# Altium schematic sheet LPGDetA1_out_ree.SchDoc
size A4; Subtitle0: Odtworzony schemat; Subtitle1: plytki glownej czujnika ALPA EcoWent - CO; LotOfPieces: 1; SVNPath: SVNPath
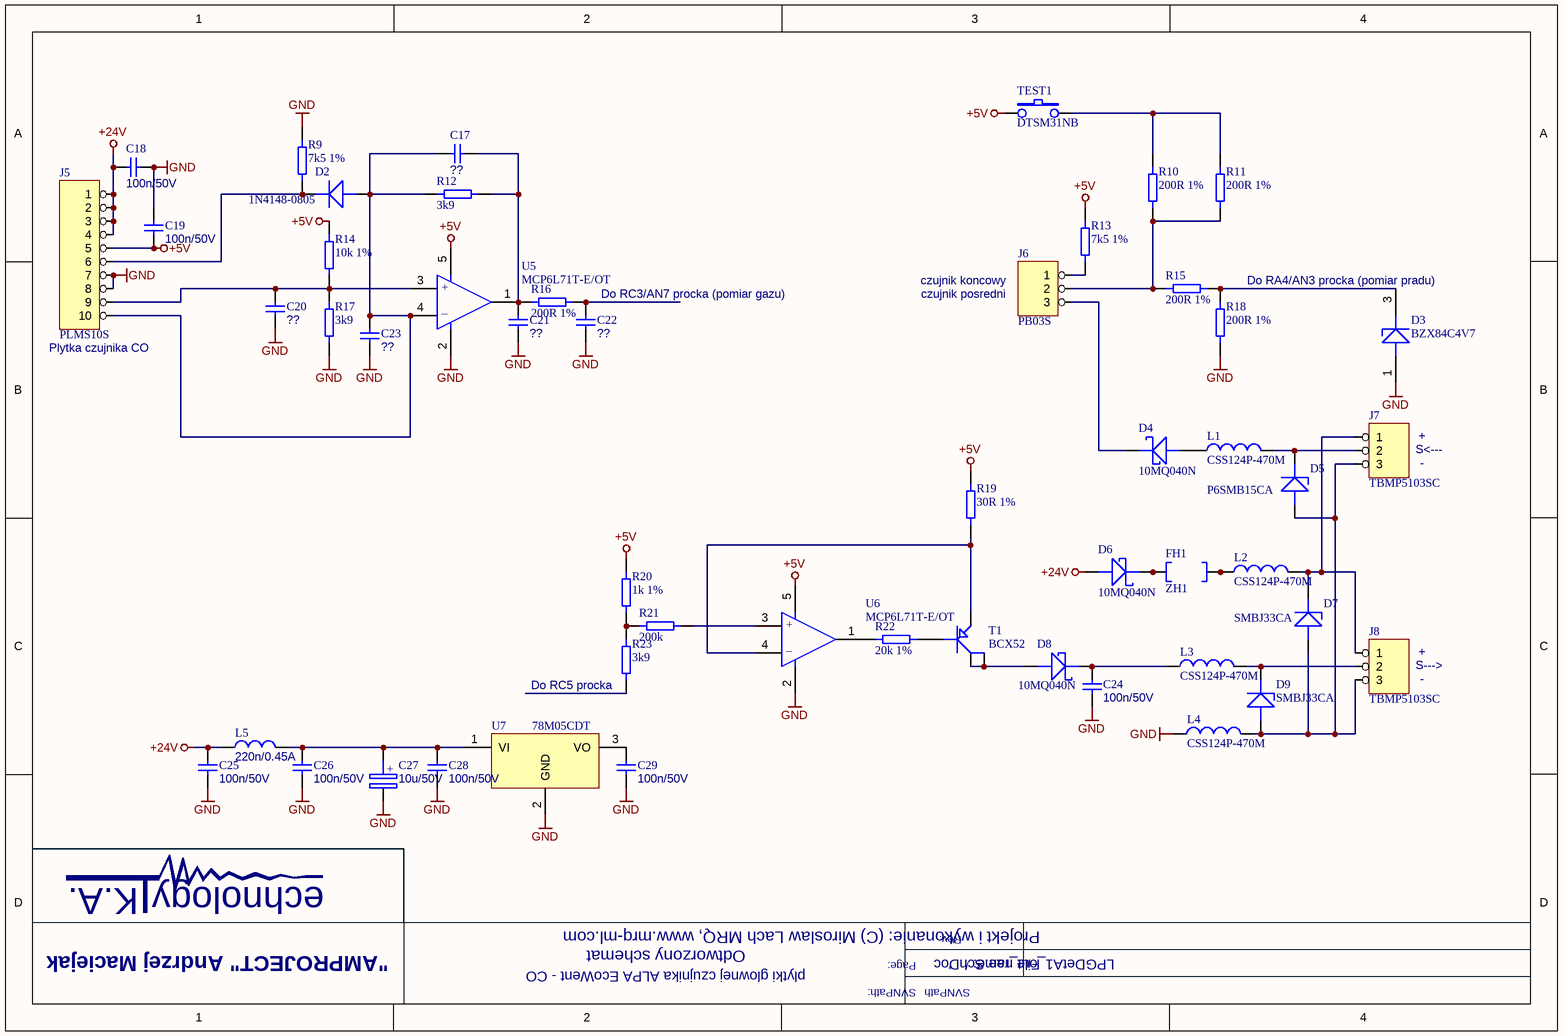
[diagram p0: LPGDetA1_out_ree.SchDoc]

## Parts
?  (no value)
C17  OtherParams: ??  [0805]  (hidden comment: CC0805JRNPO9BN101)
C18  OtherParams: 100n/50V  [0805]  (hidden comment: CL21B104KBCNNNC)
C19  OtherParams: 100n/50V  [0805]  (hidden comment: CL21B104KBCNNNC)
C20  OtherParams: ??  [0805]  (hidden comment: CC0805JRNPO9BN101)
C21  OtherParams: ??  [0805]  (hidden comment: CC0805JRNPO9BN101)
C22  OtherParams: ??  [0805]  (hidden comment: CC0805JRNPO9BN101)
C23  OtherParams: ??  [0805]  (hidden comment: CC0805JRNPO9BN101)
C24  OtherParams: 100n/50V  [0805]  (hidden comment: CL21B104KBCNNNC)
C25  OtherParams: 100n/50V  [0805]  (hidden comment: CL21B104KBCNNNC)
C26  OtherParams: 100n/50V  [0805]  (hidden comment: CL21B104KBCNNNC)
C27  OtherParams: 10u/50V  [CE6.3x5.5]  (hidden comment: CE10/50-SMD)
C28  OtherParams: 100n/50V  [0805]  (hidden comment: CL21B104KBCNNNC)
C29  OtherParams: 100n/50V  [0805]  (hidden comment: CL21B104KBCNNNC)
D2  1N4148-0805  [D0805]
D3  BZX84C4V7  [SOT23-3]
D4  10MQ040N  [SMA]
D5  P6SMB15CA  [SMB]
D6  10MQ040N  [SMA]
D7  SMBJ33CA  [SMB]
D8  10MQ040N  [SMA]
D9  SMBJ33CA  [SMB]
FH1  ZH1  [FUSE2]
J5  PLMS10S  [PLMS10S]
J6  PB03S  [PB03S]
J7  TBMP5103SC  [TBMP5103SC]
J8  TBMP5103SC  [TBMP5103SC]
L1  CSS124P-470M  [B82477]
L2  CSS124P-470M  [B82477]
L3  CSS124P-470M  [B82477]
L4  CSS124P-470M  [B82477]
L5  OtherParams: 220n/0.45A  [1210]  (hidden comment: DL1210-0.22)
R9  OtherParams: 7k5 1%  [0805]  (hidden comment: 0805WAF 7K5 T5E)
R10  OtherParams: 200R 1%  [0805]  (hidden comment: 0805WAF 200R T5E)
R11  OtherParams: 200R 1%  [0805]  (hidden comment: 0805WAF 200R T5E)
R12  OtherParams: 3k9  [0805]  (hidden comment: 0805WAJ 3K9 T5E)
R13  OtherParams: 7k5 1%  [0805]  (hidden comment: 0805WAF 7K5 T5E)
R14  OtherParams: 10k 1%  [0805]  (hidden comment: 0805WAF10KT5E)
R15  OtherParams: 200R 1%  [0805]  (hidden comment: 0805WAF 200R T5E)
R16  OtherParams: 200R 1%  [0805]  (hidden comment: 0805WAF 200R T5E)
R17  OtherParams: 3k9  [0805]  (hidden comment: 0805WAJ 3K9 T5E)
R18  OtherParams: 200R 1%  [0805]  (hidden comment: 0805WAF 200R T5E)
R19  OtherParams: 30R 1%  [0805]  (hidden comment: 0805WAF 30R T5E)
R20  OtherParams: 1k 1%  [0805]  (hidden comment: 0805WAF 1K T5E)
R21  OtherParams: 200k  [0805]  (hidden comment: 0805WAJ 200K T5E)
R22  OtherParams: 20k 1%  [1206_0805]  (hidden comment: 0805WAF 20K T5E)
R23  OtherParams: 3k9  [0805]  (hidden comment: 0805WAJ 3K9 T5E)
T1  BCX52  [SOT-89_WAVE_V2]
TEST1  DTSM31NB  [DTSM31NB]
U5  MCP6L71T-E/OT  [SOT23-5]
U6  MCP6L71T-E/OT  [SOT23-5]
U7  78M05CDT  [TO-252]

## Nets
+5V: C19.2 J5.5 R13.2 R14.1 R19.2 R20.2 TEST1.1 U5.5(PLUS_V) U6.5(PLUS_V)
+24V: C18.2 C25.2 D6.ANOD J5.1 J5.2 J5.3 J5.4 L5.1
GND: C18.1 C19.1 C20.1 C21.2 C22.2 C23.1 C24.1 C25.1 C26.1 C27.1 C28.1 C29.1 D3.1 J5.7 J5.8 L4.1 R9.2 R17.1 R18.2 U5.2(MINUS_V) U6.2(MINUS_V) U7.2(GND)
NetC17_1: C17.1 C21.1 R12.2 R16.2 U5.1(OUTPUT)
NetC17_2: C17.2 C23.2 D2.ANOD J5.10 R12.1 U5.4(MINUS_INPUT)
NetC20_2: C20.2 J5.9 R14.2 R17.2 U5.3(PLUS_INPUT)
NetC22_1: C22.1 R16.1
NetC24_2: C24.2 D8.CATH L3.1
NetC26_2: C26.2 C27.2 C28.2 L5.2 U7.1(VI)
NetC29_2: C29.2 U7.3(VO)
NetD2_CATH: D2.CATH J5.6 R9.1
NetD3_3: D3.3 R15.2 R18.1
NetD4_ANOD: D4.ANOD L1.1
NetD4_CATH: D4.CATH J6.3
NetD5_ANOD: D5.ANOD D7.ANOD D9.ANOD J7.3 J8.3 L4.2
NetD5_CATH: D5.CATH J7.2 L1.2
NetD6_CATH: D6.CATH FH1.1 FH1.3 FH1.4 FH1.6
NetD7_CATH: D7.CATH J7.1 J8.1 L2.2
NetD8_ANOD: D8.ANOD T1.2(COLL) T1.4(COLL)
NetD9_CATH: D9.CATH J8.2 L3.2
NetFH1_2: FH1.2 FH1.5 FH1.7 FH1.8 L2.1
NetJ6_1: J6.1 R13.1
NetJ6_2: J6.2 R10.1 R11.1 R15.1
NetR10_2: R10.2 R11.2 TEST1.2
NetR19_1: R19.1 T1.1(EMIT) U6.4(MINUS_INPUT)
NetR20_1: R20.1 R21.1 R23.1
NetR21_2: R21.2 U6.3(PLUS_INPUT)
NetR22_1: R22.1 U6.1(OUTPUT)
NetR22_2: R22.2 T1.3(BASE)

Not connected (* = marked no-connect by the designer): R23 2

## Notes on the sheet
- Do RC3/AN7 procka (pomiar gazu)
- (near J6) czujnik posredni
- czujnik koncowy
- Do RA4/AN3 procka (pomiar pradu)
- (near J5) Plytka czujnika CO
- +
- (near J7) -
- (near J7) S<---
- (near J8) +
- (near R23) Do RC5 procka
- (near J8) -
- (near J8) S--->
- K.A.
- echnology
- Projekt i wykonanie: (C) Miroslaw Lach MRQ, www.mrq-ml.com
- "AMPROJECT" Andrzej Maciejak
- SVNPath:
- Page:
- Rev.
- /
- File name:
- (in symbol CE10/50-SMD[[/\]]CE6.3x5.5[[/\]]50V[[/\]]20%[[/\]]10u/50V) +
- (in symbol MCP6L71T-E/OT[[/\]]SOT23-5) +; _

## Library data of the parts
? = KATECHNOLOGYLOGO
C17 C20-C23 = CC0805JRNPO9BN101[[/\]]0805[[/\]]50V[[/\]]5%[[/\]]100p/50V: MaxVoltage: 50V; Tolerance: 5%; Descript: capacitor 100pF 0805 50V NPO 5%; Reference5: CC0805JRNPO9101; Currency5: PLN; Amount5: 100+; Value: CC0805JRNPO9BN101; Dimensions: 0805; ComponentLink1Description: Datasheet; ComponentLink1URL: http://www.mrq-ml.com/Parts/Capacitors/cc_np0_yageo.pdf; Supplier5: tme.pl; Manufacturer5: Yageo; Typ5: CC0805JRNPO9BN101; Price5: 0,029; DateOfPrice5: 2010-09-07
C18 C19 C24-C26 C28 C29 = CL21B104KBCNNNC[[/\]]0805[[/\]]50V[[/\]]10%[[/\]]100n/50V: MaxVoltage: 50V; Tolerance: 10%; Descript: capacitor 100nF/50V, 0805, X7R, 10%; Currency5: PLN; Amount5: 100+; Value: CL21B104KBCNNNC; Dimensions: 0805; ComponentLink1Description: Datasheet; ComponentLink1URL: http://www.mrq-ml.com/Parts/Capacitors/mlcc_samsung.pdf; Supplier5: tme.pl; Reference5: CL21B104KBCNNNC; Manufacturer5: Samsung; Typ5: CL21B104KBCNNNC; Price5: 0,025; DateOfPrice5: 2012-09-19; Price1: 0,012
C27 = CE10/50-SMD[[/\]]CE6.3x5.5[[/\]]50V[[/\]]20%[[/\]]10u/50V: MaxVoltage: 50V; Tolerance: 20%; Descript: capacitor electrolythic 10uF/50V, 20%, 6.3x5.5mm; Currency5: PLN; Amount5: 10+; Value: CE10/50-SMD; Dimensions: CE6.3x5.5; Supplier5: tme.pl; Reference5: CE10/50-SMD; Price5: 0,29; DateOfPrice5: 2011-11-01
D2 = 1N4148-0805[[/\]]D0805: Descript: Small signal diode; Currency5: PLZ; Amount5: 25+; Value: 1N4148-0805; Dimensions: D0805; Supplier5: tme.pl; Reference5: 1N4148-0805; Price5: 0,084; DateOfPrice5: 2012-09-21; Price1: 0,052
D3 = BZX84C4V7[[/\]]SOT23-3: Descript: Zener diode 4.7V, 0.3W, SOT-23; Typ5: BZX84-C4V7.215; Currency5: PLZ; Amount5: 25+; Value: BZX84C4V7; Dimensions: SOT23-3; ComponentLink1Description: Datasheet; ComponentLink1URL: http://www.mrq-ml.com/Parts/Diodes/BZX84_SERIES_3.pdf; Supplier5: tme.pl; Reference5: BZX84C4V7; Manufacturer5: NXP; Price5: 0,11; DateOfPrice5: 2010-10-06
D4 D6 D8 = 10MQ040N[[/\]]SMA: Descript: Diode type:Schottky; Voltage, Vrrm:40V; Current, If av:1.5A; Voltage, Vf max:0.62V; Case style:SMA; Typ5: 10MQ040NTRPBF; Currency5: PLN; Amount5: 5+; Value: 10MQ040N; Dimensions: SMA; ComponentLink1Description: Datasheet; ComponentLink1URL: http://mrq-ml.com/Parts/Diodes/10mq040n.pdf; Supplier5: tme.pl; Reference5: 10MQ040N; Manufacturer5: Vishay; Price5: 0,5; DateOfPrice5: 2012-09-21
D5 = P6SMB15A[[/\]]SMB: Descript: Transient Suppresion Unidirectional Diode 15V 600W, case SMB; Reference5: P6SMB15A-LF; Currency5: PLZ; Amount5: 3+; Value: P6SMB15CA; Dimensions: SMB; ComponentLink1Description: Datasheet; ComponentLink1URL: http://www.mrq-ml.com/Parts/Diodes/Littelfuse_TVS-Diodes_P6SMB.pdf; Supplier5: tme.pl; Manufacturer5: Littelfuse; Typ5: P6SMB15A; Price5: 0,7; DateOfPrice5: 2012-09-30; Price1: 0,48
D7 D9 = P6SMB36A[[/\]]SMB: Descript: Transient Suppresion Unidirectional Diode 15V 600W, case SMB; Reference5: P6SMB36A-LF; Currency5: PLN; Amount5: 10+; Value: SMBJ33CA; Dimensions: SMB; ComponentLink1Description: Datasheet; ComponentLink1URL: http://www.mrq-ml.com/Parts/Diodes/Littelfuse_TVS-Diodes_P6SMB.pdf; Supplier5: tme.pl; Manufacturer5: Littelfuse; Typ5: P6SMB36A; Price5: 0,61; DateOfPrice5: 2012-10-15; Price1: 0,48
FH1 = ZH1[[/\]]ZH1[[/\]]FUSE2: Descript: Fuse holder 5x20mm; Currency5: PLZ; Amount5: 10+; Value: ZH1; OtherParams: ZH1; Dimensions: FUSE2; Supplier5: tme.pl; Reference5: ZH1; Manufacturer5: PROFFUSE; Typ5: ZH1; Price5: 1,02; DateOfPrice5: 2012-09-18
J5 = PLMS10S[[/\]]20x2mm: Descript: connector 2.00mm pitch, 10 poles, one row; Reference5: PLMS40S-LF; Currency5: PLN; Amount5: 1+; Value: PLMS10S; Dimensions: 20x2mm; ComponentLink1Description: Datasheet; ComponentLink1URL: http://www.mrq-ml.com/Parts/Connectors/plms40s-lf.pdf; Supplier5: maritex.com.pl; Price5: 0,1625; DateOfPrice5: 2010-11-19
J6 = PB03S[[/\]]3x2.54: Descript: connector 2,54 pitch, THT, 3x1 poles, straight; Reference5: PB03S-LF; Currency5: PLN; Amount5: 10+; Value: PB03S; Dimensions: 3x2.54; ComponentLink1Description: Datasheet; ComponentLink1URL: http://www.mrq-ml.com/Parts/Connectors/pbxxs.pdf; Supplier5: maritex.com.pl; Price5: 0,092; DateOfPrice5: 2011-06-30
J7 J8 = TBMP5103SC[[/\]]TBMP5103SC: Descript: connector 5.08mm pitch, 3 poles, male; Reference5: TBMP5103SC-LF; Currency5: PLN; Amount5: 1+; Value: TBMP5103SC; Dimensions: TBMP5103SC; Supplier5: maritex.com.pl; Price5: 0,26; DateOfPrice5: 2010-06-14
L1-L4 = CSS124P-470M[[/\]]B82477[[/\]]47u: OtherParams: 47u; Descript: inductor 47uH; Currency5: PLN; Value: CSS124P-470M; Dimensions: B82477
L5 = DL1210-0.22[[/\]]1210[[/\]]220n/0.45A: Descript: Chip inductor SMD, 1210, Imax=0.45A, Rdc=0.36ohm, Q=30, 0.22uH, 10%; Currency5: PLN; Amount5: 10+; Value: DL1210-0.22; Dimensions: 1210; ComponentLink1Description: Datasheet; ComponentLink1URL: http://www.mrq-ml.com/Parts/Inductors/dl1210.pdf; Supplier5: tme.pl; Reference5: DL1210-0.22; Manufacturer5: Ferrocore; Typ5: DL1210-0.22; Price5: 0,79; DateOfPrice5: 2010-05-06
R9 R13 = 0805WAF 7K5 T5E[[/\]]0805[[/\]]0.125W[[/\]]1%[[/\]]7k5 1%: DissPower: 0.125W; Tolerance: 1%; Descript: Resistor 7.5kohm, 0805, 1%; Currency5: PLN; Value: 0805WAF 7K5 T5E; Dimensions: 0805; ComponentLink1Description: Datasheet; ComponentLink1URL: http://www.mrq-ml.com/Parts/Resistors/RoyalOhm_rezystor-smd.pdf
R10 R11 R15 R16 R18 = 0805WAF 200R T5E[[/\]]0805[[/\]]0.125W[[/\]]1%[[/\]]200R 1%: DissPower: 0.125W; Tolerance: 1%; Descript: Resistor 200ohm, 1%, 0805; Reference5: SMD0805-200R-1%; Currency5: PLN; Amount5: 100+; Value: 0805WAF 200R T5E; Dimensions: 0805; ComponentLink1Description: Datasheet; ComponentLink1URL: http://www.mrq-ml.com/Parts/Resistors/RoyalOhm_rezystor-smd.pdf; Supplier5: tme.pl; Manufacturer5: Royal Ohm; Typ5: 0805WAF 200R T5E; Price5: 0,029; DateOfPrice5: 2012-09-19; Price1: 0,018
R12 R17 R23 = 0805WAJ 3K9 T5E[[/\]]0805[[/\]]0.125W[[/\]]5%[[/\]]3k9: DissPower: 0.125W; Tolerance: 5%; Descript: Resistor 3.9kohm, 0805, 5%; Reference5: SMD0805 3K9; Currency5: PLN; Amount5: 100+; Value: 0805WAJ 3K9 T5E; Dimensions: 0805; ComponentLink1Description: Datasheet; ComponentLink1URL: http://www.mrq-ml.com/Parts/Resistors/RoyalOhm_rezystor-smd.pdf; Supplier5: tme.pl; Manufacturer5: Royal Ohm; Typ5: 0805WAJ 3K9 T5E; Price5: 0,022; DateOfPrice5: 2009-10-27
R14 = 0805WAF10KT5E[[/\]]0805[[/\]]0.125W[[/\]]1%[[/\]]10k 1%: DissPower: 0.125W; Tolerance: 1%; Descript: Resistor 10kohm, 0805, 1%; Reference5: SMD0805-10K-1%; Currency5: PLN; Amount5: 100+; Value: 0805WAF10KT5E; Dimensions: 0805; ComponentLink1Description: Datasheet; ComponentLink1URL: http://www.mrq-ml.com/Parts/Resistors/RoyalOhm_rezystor-smd.pdf; Supplier5: tme.pl; Manufacturer5: Royal Ohm; Typ5: 0805WAF 10K T5E; Price5: 0,029; DateOfPrice5: 2012-07-17; Price1: 0,018
R19 = 0805WAF 30R T5E[[/\]]0805[[/\]]0.125W[[/\]]1%[[/\]]30R 1%: DissPower: 0.125W; Tolerance: 1%; Descript: Resistor 30ohm, 0805, 1%; Reference5: SMD0805 30R 1%; Currency5: PLN; Amount5: 100+; Value: 0805WAF 30R T5E; Dimensions: 0805; ComponentLink1Description: Datasheet; ComponentLink1URL: http://www.mrq-ml.com/Parts/Resistors/RoyalOhm_rezystor-smd.pdf; Supplier5: tme.pl; Manufacturer5: Royal Ohm; Typ5: 0805WAF 30R T5E; Price5: 0,026; DateOfPrice5: 2010-02-10
R20 = 0805WAF 1K T5E[[/\]]0805[[/\]]0.125W[[/\]]1%[[/\]]1k 1%: DissPower: 0.125W; Tolerance: 1%; Descript: Resistor 1kohm, 0805, 1%; Reference5: SMD0805-1K-1%; Currency5: PLN; Amount5: 100+; Value: 0805WAF 1K T5E; Dimensions: 0805; ComponentLink1Description: Datasheet; ComponentLink1URL: http://www.mrq-ml.com/Parts/Resistors/RoyalOhm_rezystor-smd.pdf; Supplier5: tme.pl; Manufacturer5: Royal Ohm; Typ5: 0805WAF 1K T5E; Price5: 0,029; DateOfPrice5: 2012-09-18; Price1: 0,018
R21 = 0805WAJ 200K T5E[[/\]]0805[[/\]]0.125W[[/\]]5%[[/\]]200k: DissPower: 0.125W; Tolerance: 5%; Descript: Resistor SMD 0805 200kohm 0.125W 5%; Reference5: SMD0805 200K; Currency5: PLN; Amount5: 100+; Value: 0805WAJ 200K T5E; Dimensions: 0805; ComponentLink1Description: Datasheet; ComponentLink1URL: http://www.mrq-ml.com/Parts/Resistors/RoyalOhm_rezystor-smd.pdf; Supplier5: tme.pl; Manufacturer5: Royal Ohm; Typ5: 0805WAJ 200K T5E; Price5: 0,037
R22 = 0805WAF 20K T5E[[/\]]0805[[/\]]0.125W[[/\]]1%[[/\]]20k 1%: DissPower: 0.125W; Tolerance: 1%; Descript: Resistor 20kohm, 0805, 1%; Reference5: SMD0805-20K-1%; Currency5: PLN; Amount5: 100+; Value: 0805WAF 20K T5E; Dimensions: 0805; ComponentLink1Description: Datasheet; ComponentLink1URL: http://www.mrq-ml.com/Parts/Resistors/RoyalOhm_rezystor-smd.pdf; Supplier5: tme.pl; Manufacturer5: Royal Ohm; Typ5: 0805WAF 20K T5E; Price5: 0,029; DateOfPrice5: 2012-09-21; Price1: 0,018
T1 = BCX52[[/\]]SOT-89: Descript: 60V, 1A PNP medium power transistor; Reference5: BCX52-16; Currency5: PLN; Amount5: 5+; Typ5: BCX52-16.115; Value: BCX52; Dimensions: SOT-89; ComponentLink1Description: Datasheet; ComponentLink1URL: http://www.mrq-ml.com/Parts/Transistors/BCP52_BCX52.pdf; Supplier5: tme.pl; Price5: 0,49; DateOfPrice5: 2012-11-16; Manufacturer5: NXP; Price1: 0,35
TEST1 = DTSM31NB[[/\]]DTSM31NB[[/\]]DTSM31NB: Descript: microswitch SMD, 4.3mm, 1.6N; Typ5: DTSM-31N-B; Currency5: PLN; Amount5: 5+; Value: DTSM31NB; OtherParams: DTSM31NB; Dimensions: DTSM31NB; Supplier5: tme.pl; Reference5: DTSM31NB; Manufacturer5: Canal Electronic; Price5: 0,8; DateOfPrice5: 2011-05-29
U5 U6 = MCP6L71T-E/OT[[/\]]SOT23-5: Descript: 2MHz, 85uA, OpAmp, SOT23-5; Reference5: 1715861; Currency5: PLN; Amount5: 1+; Value: MCP6L71T-E/OT; Dimensions: SOT23-5; ComponentLink1Description: Datasheet; ComponentLink1URL: http://www.mrq-ml.com/Parts/ICs/MCP6L71.pdf; Supplier5: farnell.com; Price5: 1,86; DateOfPrice5: 2012-11-03; Price1: 1,33; Manufacturer5: Microchip; Typ5: MCP6L71T-E/OT
U7 = 78M05CDT[[/\]]TO-252: Descript: +5V voltage regulator TO-252, 0.5A; Currency5: PLN; Amount5: 5+; Value: 78M05CDT; Dimensions: TO-252; ComponentLink1Description: Datasheet; ComponentLink1URL: http://www.mrq-ml.com/Parts/ICs/l78m12c.pdf; Supplier5: tme.pl; Reference5: 78M05CDT; Price5: 0,68; DateOfPrice5: 2010-09-07